# EAGLE design infinity_mirror_rev_g (EAGLE 9.6.2)
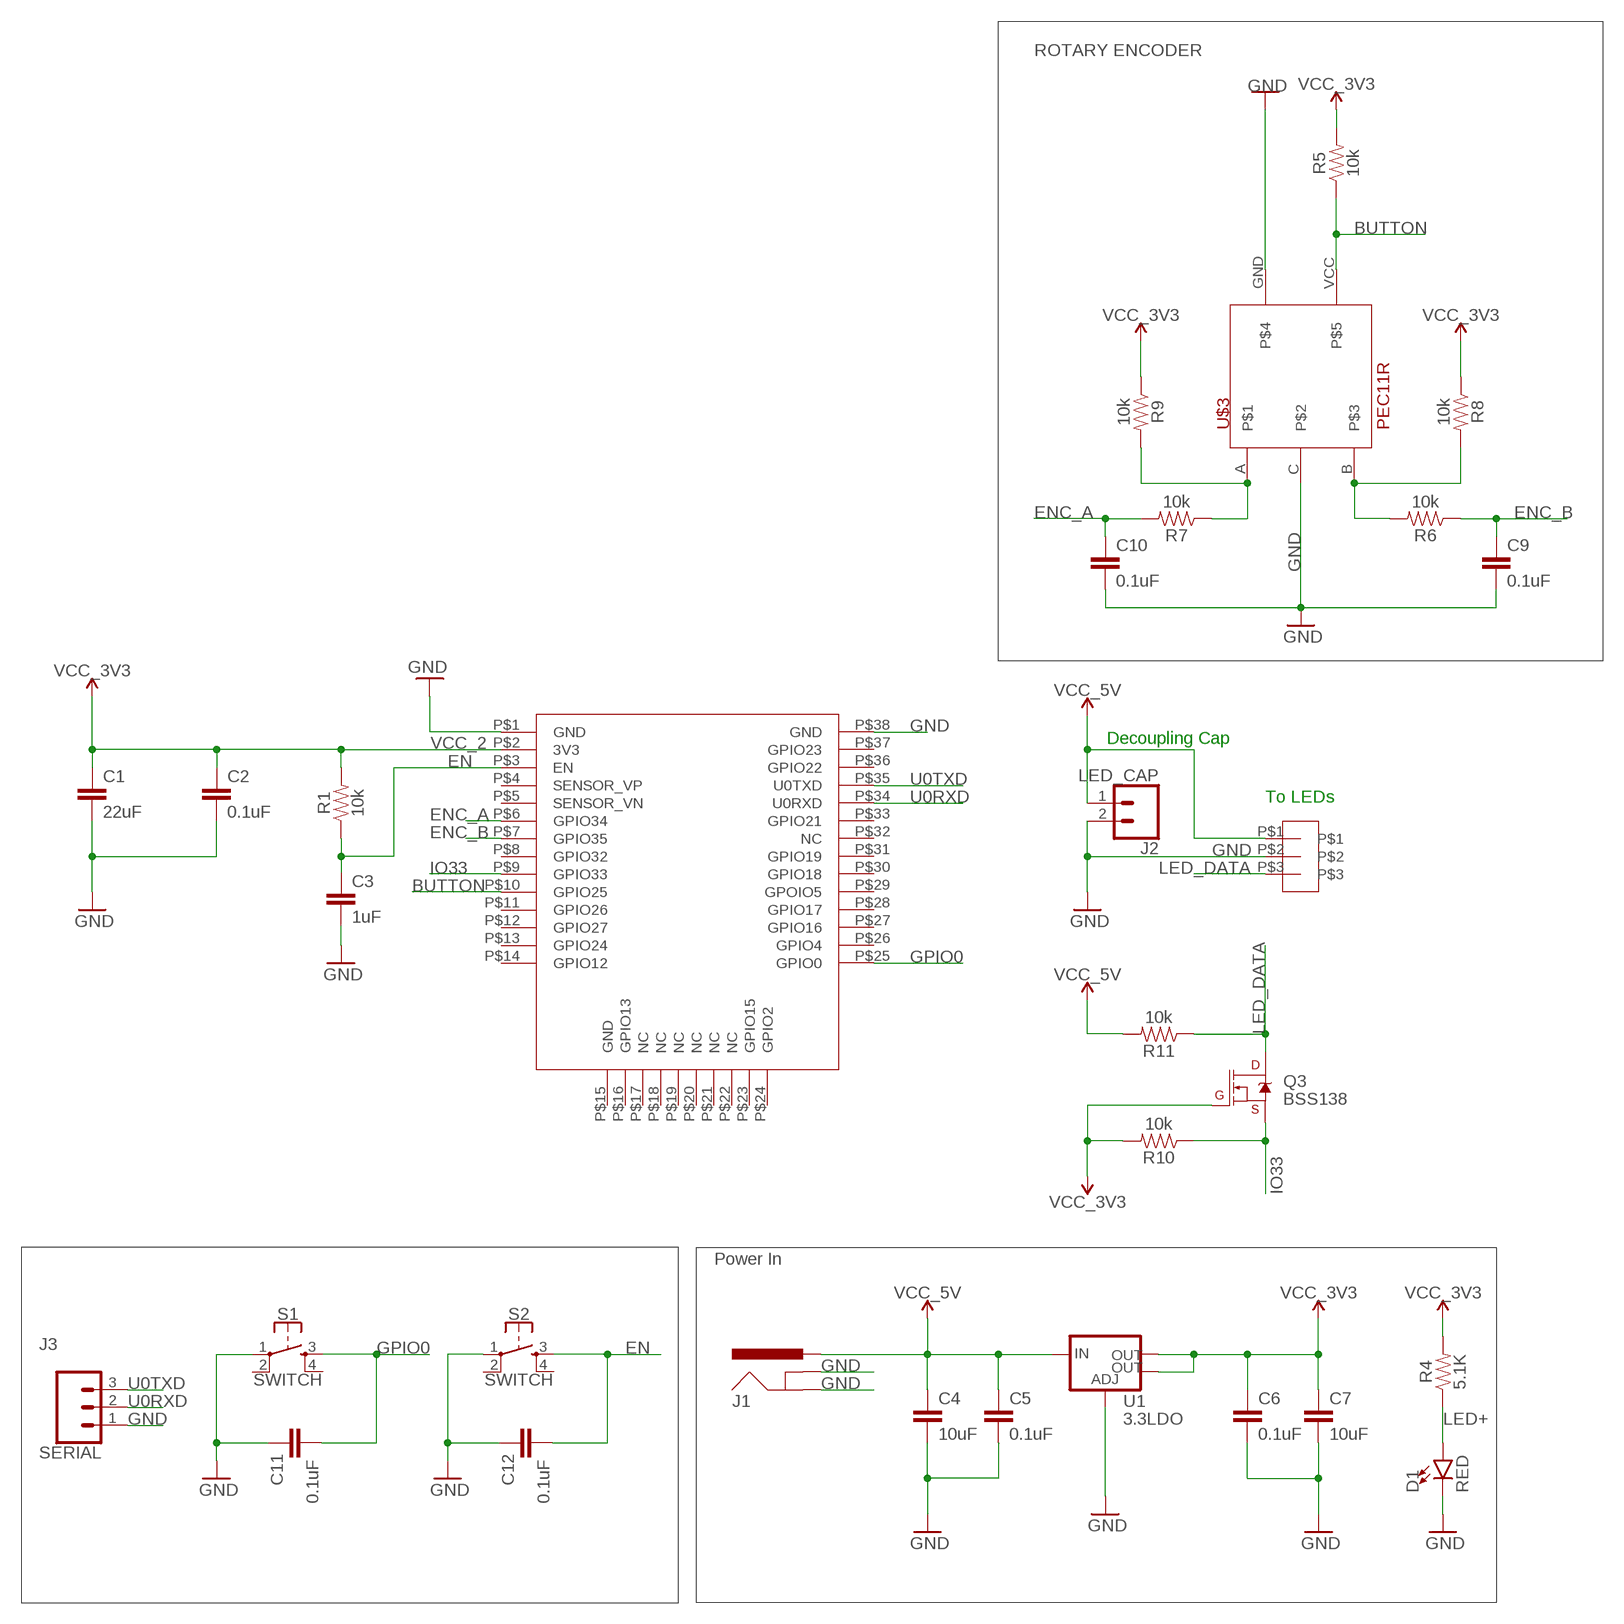
[diagram p0: schematic, sheet 1]

## Parts
C1  22uF  CAPACITOR  [0805]
C2  0.1uF  CAPACITOR  [0805]
C3  1uF  CAPACITOR  [0805]
C4  10uF  CAPACITOR  [0805]
C5  0.1uF  CAPACITOR  [0805]
C6  0.1uF  CAPACITOR  [0805]
C7  10uF  CAPACITOR  [0805]
C9  0.1uF  CAPACITOR  [0805]
C10  0.1uF  CAPACITOR  [0805]
C11  0.1uF  CAPACITOR  [0805]
C12  0.1uF  CAPACITOR  [0805]
D1  RED  LED-RED1206  [LED-1206]
J1  POWER_JACKPTH_BREAD  [POWER_JACK_PTH_BREAD]
J2  LED_CAP  CONN_02  [1X02]
J3  SERIAL  CONN_03  [1X03]
Q3  BSS138  MOSFET-NCH-BSS138  [SOT23-3]
R1  10k  RESISTOR  [0805]
R4  5.1K  RESISTOR  [0805]
R5  10k  RESISTOR  [0805]
R6  10k  RESISTOR  [0805]
R7  10k  RESISTOR  [0805]
R8  10k  RESISTOR  [0805]
R9  10k  RESISTOR  [0805]
R10  10k  RESISTOR  [0805]
R11  10k  RESISTOR  [0805]
S1  SWITCH  MOMENTARY-SWITCH-SPST-2-SMD-5.2MM-TALL  [TACTILE_SWITCH_SMD_5.2MM]
S2  SWITCH  MOMENTARY-SWITCH-SPST-2-SMD-5.2MM-TALL  [TACTILE_SWITCH_SMD_5.2MM]
U1  3.3LDO  V_REG_LM1117SOT223  [SOT223]
U$1  ESP32-WROOM-32E  [ESP32-WROOM-32E]
U$2  3-PIN-JST  [3-PIN-JST]
U$3  PEC11R  PEC11R_ROTARY_ENCODER  [PEC11R-4320F-S0012]

## Nets
BUTTON: R5.1 U$1.P$10(GPIO25) U$3.VCC
EN: C3.1 C12.2 R1.1 S2.3 U$1.P$3(EN)
ENC_A: C10.1 R7.2 U$1.P$6(GPIO34)
ENC_B: C9.1 R6.1 U$1.P$7(GPIO35)
GND: C1.2 C2.2 C3.2 C4.2 C5.2 C6.2 C7.2 C9.2 C10.2 C11.1 C12.1 D1.C J1.GND J1.GNDBREAK J2.2 J3.1 S1.1 S2.1 U1.1(ADJ) U$1.P$1(GND) U$1.P$38(GND) U$2.P$2 U$3.C U$3.GND
GPIO0: C11.2 S1.3 U$1.P$25(GPIO0)
IO33: Q3.2(S) R10.1 U$1.P$9(GPIO33)
LED+: D1.A R4.1
LED_DATA: Q3.3(D) R11.1 U$2.P$3
N$2: R6.2 R8.2 U$3.B
N$3: R7.1 R9.2 U$3.A
U0RXD: J3.2 U$1.P$34(U0RXD)
U0TXD: J3.3 U$1.P$35(U0TXD)
VCC_1: C4.1 C5.1 J1.PWR J2.1 R11.2 U1.3(IN) U$2.P$1 ; supply symbol labelled VCC_5V
VCC_2: C1.1 C2.1 C6.1 C7.1 Q3.1(G) R1.2 R4.2 R5.2 R8.1 R9.1 R10.2 U1.2(OUT) U1.4(OUT) U$1.P$2(3V3) ; supply symbol labelled VCC_3V3
Unconnected: S1.2 S1.4 S2.2 S2.4 U$1.P$4(SENSOR_VP) U$1.P$5(SENSOR_VN) U$1.P$8(GPIO32) U$1.P$11(GPIO26) U$1.P$12(GPIO27) U$1.P$13(GPIO24) U$1.P$14(GPIO12) U$1.P$15(GND) U$1.P$16(GPIO13) U$1.P$17(NC) U$1.P$18(NC) U$1.P$19(NC) U$1.P$20(NC) U$1.P$21(NC) U$1.P$22(NC) U$1.P$23(GPIO15) U$1.P$24(GPIO2) U$1.P$26(GPIO4) U$1.P$27(GPIO16) U$1.P$28(GPIO17) U$1.P$29(GPOIO5) U$1.P$30(GPIO18) U$1.P$31(GPIO19) U$1.P$32(NC) U$1.P$33(GPIO21) U$1.P$36(GPIO22) U$1.P$37(GPIO23)

## Notes on the sheet
- ROTARY ENCODER
- Decoupling Cap
- To LEDs
- Power In

## Library data of the parts
C1-C7 C9-C12 = _111_IH:CAPACITOR
D1 = SparkFun-LED:LED-RED: Red SMD LED Used in manufacturing of most products at SparkFun Packages: 0603 - SMD 0603 package [Product Link] <http://docs.avagotech.com/docs/AV02-0551EN> 0603 SMART - SMD 0603 SMART package ( more efficient and expensive)[Product Link] <http://www.osram-os.com/Graphics/XPic2/00077099_0.pdf> 1206 - SMD1206 package [Product Link] <https://www.sparkfun.com/datasheets/DevTools/LilyPad/Q150OVS4.pdff> SparkFun Products: Pro Mini 328 -5V <https://www.sparkfun.com/products/821> RedBoard <https://www.sparkfun.com/products/12757> IOIO-OTG <https://www.sparkfun.com/products/13613>; PROD_ID: DIO-09912
J1 = SparkFun-Connectors:POWER_JACK: Power Jack Connector This is the standard 5.5mm barrel jack for power. The PTH is the most common, proven, reliable, footprint. The Slot footprint only works if the mill layer is transmitted to the PCB fab house so be warned. Here are the connectors we sell at SparkFun: DC Barrel Power Jack/Connector <https://www.sparkfun.com/products/119> (PRT-00119) DC Barrel Power Jack/Connector (SMD) <https://www.sparkfun.com/products/12748> (PRT-12748) DC Barrel Jack Adapter - Breadboard Compatible <https://www.sparkfun.com/products/10811> (PRT-10811) It is used on this SparkFun product (and many, many others): SparkFun RedBoard - Programmed with Arduino <https://www.sparkfun.com/products/12757> (DEV-12757) Also, if you need a mating power supply or connector, please check these out: Wall Adapter Power Supply - 9VDC 650mA <https://www.sparkfun.com/products/298> (TOL-00298) DC Barrel Jack Adapter - Male <https://www.sparkfun.com/products/10287> (PRT-10287); PROD_ID: PRT-10811
J2 = SparkFun-Connectors:CONN_02: Multi connection point. Often used as Generic Header-pin footprint for 0.1 inch spaced/style header connections On any of the 0.1 inch spaced packages, you can populate with these: Break Away Headers - Straight <https://www.sparkfun.com/products/116> (PRT-00116) Break Away Male Headers - Right Angle <https://www.sparkfun.com/products/553> (PRT-00553) Female Headers <https://www.sparkfun.com/products/115> (PRT-00115) Break Away Headers - Machine Pin <https://www.sparkfun.com/products/117> (PRT-00117) Break Away Female Headers - Swiss Machine Pin <https://www.sparkfun.com/products/743> (PRT-00743) For SCREWTERMINALS and SPRING TERMINALS visit here: Screw Terimnals on SparkFun.com <https://www.sparkfun.com/search/results?term=Screw+Terminals> (5mm/3.5mm/2.54mm spacing) This device is also useful as a general connection point to wire up your design to another part of your project. Our various solder wires solder well into these plated through hole pads. Hook-Up Wire - Assortment (Stranded, 22 AWG) <https://www.sparkfun.com/products/11375> (PRT-11375) Hook-Up Wire - Assortment (Solid Core, 22 AWG) <https://www.sparkfun.com/products/11367> (PRT-11367) View the entire wire category on our website here <https://www.sparkfun.com/categories/141> Special notes: Molex polarized connector foot print use with: PRT-08233 with associated crimp pins and housings. 2.54_SCREWTERM for use with PRT-10571. 3.5mm Screw Terminal footprints for PRT-08084 5mm Screw Terminal footprints for use with PRT-08432
J3 = SparkFun-Connectors:CONN_03: Multi connection point. Often used as Generic Header-pin footprint for 0.1 inch spaced/style header connections On any of the 0.1 inch spaced packages, you can populate with these: Break Away Headers - Straight <https://www.sparkfun.com/products/116> (PRT-00116) Break Away Male Headers - Right Angle <https://www.sparkfun.com/products/553> (PRT-00553) Female Headers <https://www.sparkfun.com/products/115> (PRT-00115) Break Away Headers - Machine Pin <https://www.sparkfun.com/products/117> (PRT-00117) Break Away Female Headers - Swiss Machine Pin <https://www.sparkfun.com/products/743> (PRT-00743) Stackable Header - 3 Pin (Female, 0.1") <https://www.sparkfun.com/products/13875> (PRT-13875) For SCREWTERMINALS and SPRING TERMINALS visit here: Screw Terimnals on SparkFun.com <https://www.sparkfun.com/search/results?term=Screw+Terminals> (5mm/3.5mm/2.54mm spacing) This device is also useful as a general connection point to wire up your design to another part of your project. Our various solder wires solder well into these plated through hole pads. Hook-Up Wire - Assortment (Stranded, 22 AWG) <https://www.sparkfun.com/products/11375> (PRT-11375) Hook-Up Wire - Assortment (Solid Core, 22 AWG) <https://www.sparkfun.com/products/11367> (PRT-11367) View the entire wire category on our website here <https://www.sparkfun.com/categories/141> Special notes: Molex polarized connector foot print use with SKU : PRT-08232 with associated crimp pins and housings.
Q3 = SparkFun-DiscreteSemi:MOSFET-NCH: N-channel MOSFETs Voltage controlled devices that allow control of high current outputs. SparkFun Products: SparkFun OpenScale <https://www.sparkfun.com/products/13261> SparkFun Digital Sandbox <https://www.sparkfun.com/products/12651> SparkFun Monster Moto Shield <https://www.sparkfun.com/products/10182> SparkFun MOSFET Power Controller <https://www.sparkfun.com/products/11214>; PROD_ID: TRANS-00830; VALUE: 220mA/50V/3.5Ω
R1 R4-R11 = _111_IH:RESISTOR
S1 S2 = SparkFun-Switches:MOMENTARY-SWITCH-SPST-2: Momentary Switch (Pushbutton) - SPST - Two Circuits Normally-open (NO) SPST momentary switches (buttons, pushbuttons). Schematic symbol includes two switch circuits. Variants SMD-4.6MMX2.8MM - 4.60mm x 2.80mm Tactile Momentary Button Switch - Used on SparkFun Pro Micro - RP2040 <https://www.sparkfun.com/products/17717> SMD-5.2MM - Mini Pushbutton Switch - SMD <https://www.sparkfun.com/products/8720> - Used on Arduino Pro Mini <https://www.sparkfun.com/products/11114>; PROD_ID: SWCH-14139
U1 = SparkFun-IC-Power:V_REG_LM1117: Voltage Regulator LM1117 Standard adjustable voltage regulator but in SMD form. Spark Fun Electronics SKU : COM-00595; PROD_ID: VREG-08170
U$1 = infinity_mirror_revd:ESP32-WROOM-32E
U$2 = infinity_mirror_revd:3-PIN-JST
U$3 = infinity_mirror_revd:PEC11R_ROTARY_ENCODER: 4 = PC Pin Horizontal / Rear Facing 3 = 12 Detents 20 = 20.0mm long shaft F = Metal Flatted Shaft S = Push Momentary Switch 001 = 12 pulses per 360

## Board
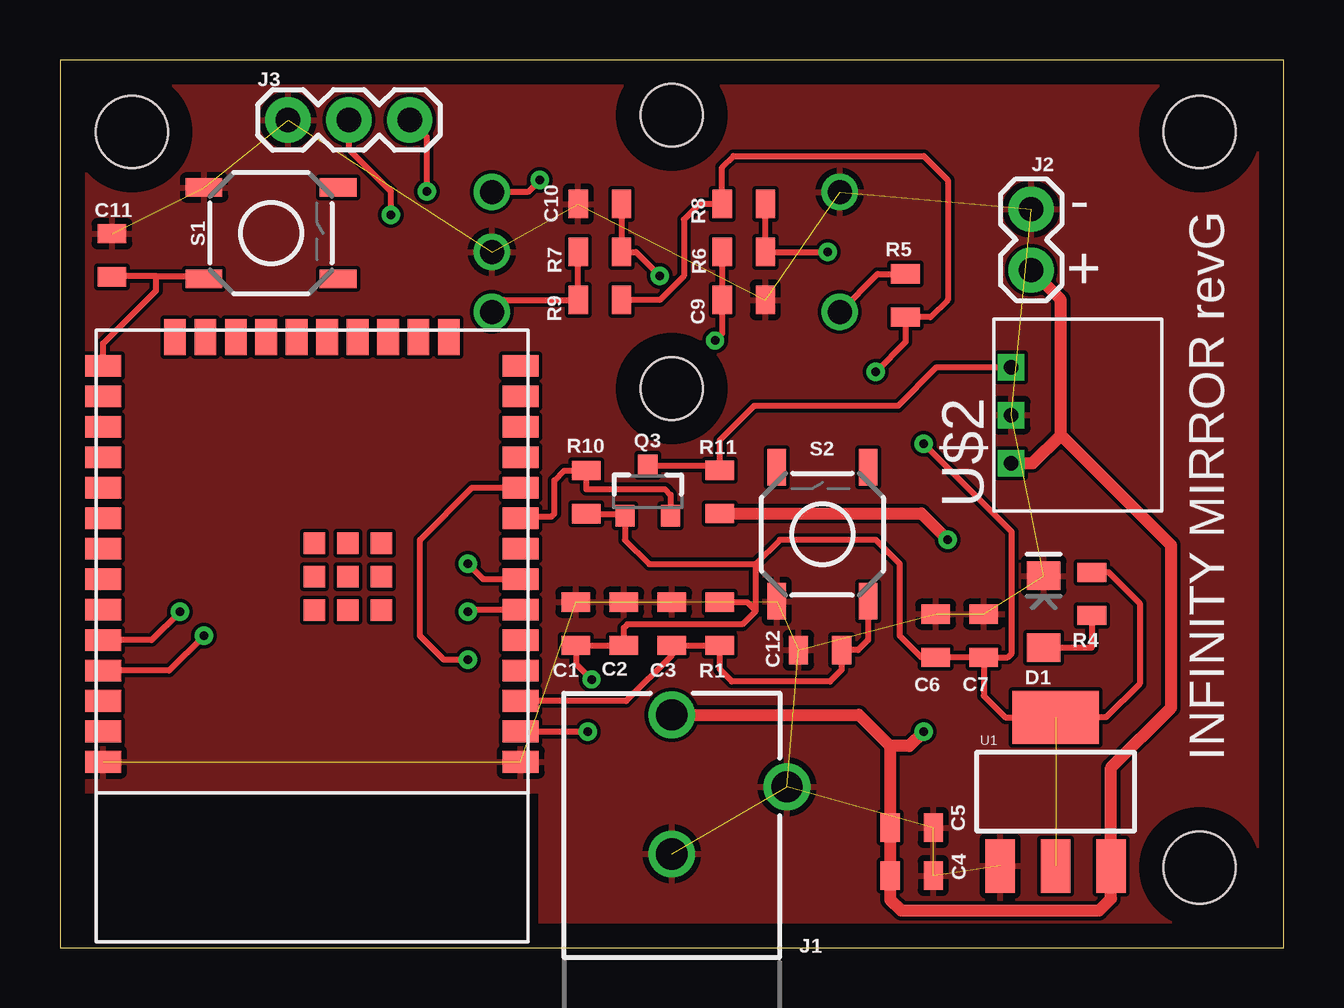
[diagram p1: board, top side]
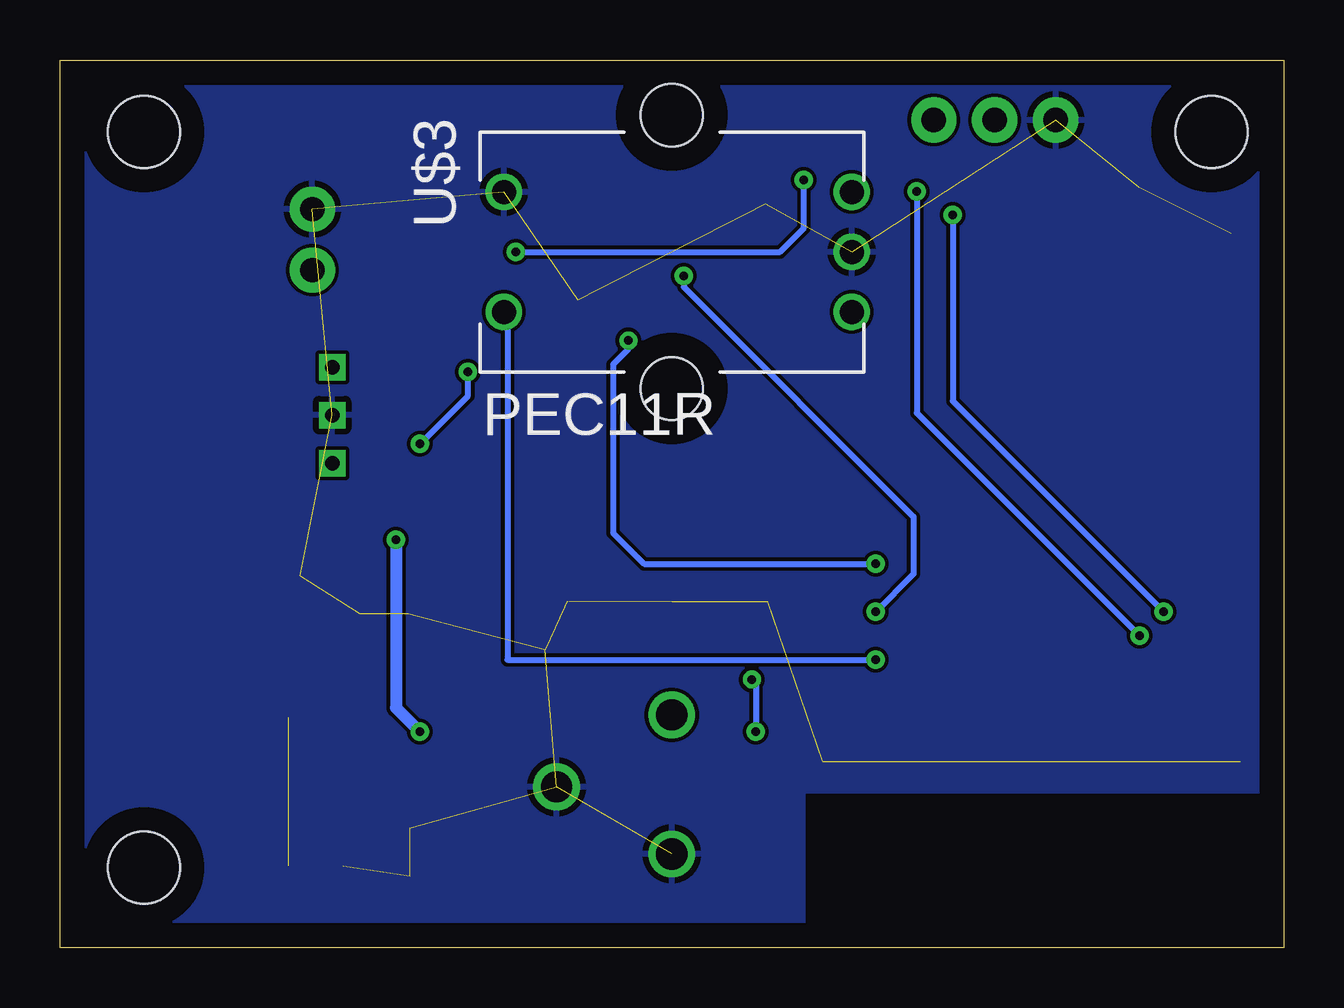
[diagram p2: board, bottom side, seen from below]

Size 51 x 37 mm. Coordinates in mm from the lower left corner, seen from the top.
Outline: 0,0 51,0 51,37 0,37 0,0
Copper layers (1*16): Top 0.035mm / dielectric 1.5mm / Bottom 0.035mm
Design rules "default": minimum track width 6mil, minimum drill 0.35mm, track to track 6mil, track to pad 6mil, pad to pad 6mil, via to via 6mil, smd to smd 6mil, copper to edge 40mil, drill to drill 6mil, minimum pad ring 10mil, minimum via ring 8mil, stop-mask expansion 4mil, vias tented up to drill 0mil, thermal gap 10mil
Holes 3 mm at 3,34 47.5,34 47.5,3.33
tKeepout: area 0.5,31.5 to 5.5,36.5; area 45,0.8 to 50,5.8; area 45,31.5 to 50,36.5

### Footprints (pad centres in the part's own frame; a part is rotated, then mirrored left to right if it is on the bottom)
0805 = smd 0.8 x 1.2: 1 -0.9,0; 2 0.9,0
LED-1206 = smd 1.2 x 1.4: A -1.5,0; C 1.5,0
POWER_JACK_PTH_BREAD = drill 1.3: GND 0,7.9; GNDBREAK 4.8,10.7; PWR 0,13.7
1X02 = drill 1.016 pad 1.88: 1 0,0; 2 2.54,0
1X03 = drill 1.016 pad 1.88: 1 0,0; 2 2.54,0; 3 5.08,0
SOT23-3 = smd 0.8 x 0.9: 1 -0.95,-1; 2 0.95,-1; 3 0,1.1
TACTILE_SWITCH_SMD_5.2MM = smd 1.524 x 0.762: 1 -2.794,1.905; 2 2.794,1.905; 3 -2.794,-1.905; 4 2.794,-1.905
SOT223 = smd 1.219 x 2.235: 1 -2.311,-3.099; 2 0,-3.099; 3 2.311,-3.099 | smd 3.6 x 2.2: 4 0,3.099
ESP32-WROOM-32E = smd 1.5 x 0.9: P$1 0.3,18.01; P$2 0.3,16.74; P$3 0.3,15.47; P$4 0.3,14.2; P$5 0.3,12.93; P$6 0.3,11.66; P$7 0.3,10.39; P$8 0.3,9.12; P$9 0.3,7.85; P$10 0.3,6.58; P$11 0.3,5.31; P$12 0.3,4.04; P$13 0.3,2.77; P$14 0.3,1.5; P$25 17.7,1.5; P$26 17.7,2.77; P$27 17.7,4.04; P$28 17.7,5.31; P$29 17.7,6.58; P$30 17.7,7.85; P$31 17.7,9.12; P$32 17.7,10.39; P$33 17.7,11.66; P$34 17.7,12.93; P$35 17.7,14.2; P$36 17.7,15.47; P$37 17.7,16.74; P$38 17.7,18.01 | smd 0.9 x 1.5: P$15 3.285,0.3; P$16 4.555,0.3; P$17 5.825,0.3; P$18 7.095,0.3; P$19 8.365,0.3; P$20 9.635,0.3; P$21 10.905,0.3; P$22 12.175,0.3; P$23 13.445,0.3; P$24 14.715,0.3 | smd 0.9 x 0.9: P$39 7.5,10.29; P$40 6.1,11.69; P$41 7.5,11.69; P$42 8.9,11.69; P$43 8.9,10.29; P$44 8.9,8.89; P$45 7.5,8.89; P$46 6.1,8.89; P$47 6.1,10.29
3-PIN-JST = drill 0.6 square: P$1 -2,0; P$2 0,0; P$3 2,0
PEC11R-4320F-S0012 = drill 1: A -2.5,-7.5; B 2.5,-7.5; C 0,-7.5; GND 2.5,7; VCC -2.5,7 | hole 2.6: -5.7,0; 5.7,0

### Placement (x,y rotation side)
C1  21.5,13.5 90 top
C2  23.5,13.5 90 top
C3  25.5,13.5 90 top
C4  35.5,3 0 top
C5  35.5,5 0 top
C6  36.5,13 90 top
C7  38.5,13 90 top
C9  28.5,27 0 top
C10  22.5,31 180 top
C11  2.17,28.86 270 top
C12  31.68,12.4 0 top
D1  41,14 90 top
J1  25.5,-4 0 top
J2  40.48,28.24 90 top
J3  9.5,34.5 0 top
Q3  24.5,19 0 top
R1  27.5,13.5 90 top
R4  43.01,14.74 90 top
R5  35.24,27.18 270 top
R6  28.5,29 0 top
R7  22.5,29 0 top
R8  28.5,31 0 top
R9  22.5,27 180 top
R10  21.94,18.98 270 top
R11  27.5,19 270 top
S1  8.8,29.78 0 top
S2  31.78,17.23 90 top
U1  41.5,6.5 0 top
U$1  19.5,25.75 180 top
U$2  39.65,22.19 90 top
U$3  25.5,29 90 bottom

### Tracks (layer width: path | path; a pad name or v marks a point on that pad's centre or on a via)
BUTTON  (via drill 0.35)
  Top 0.254: U$3.VCC 34.08,28.08 R5.1 | v17,12 16,12 15,13 15,17 17.17,19.17 U$1.P$10
  Bottom 0.254: U$3.VCC 32.35,26.35 32.35,12 v17,12
EN
  Top 0.254: S2.3 33.69,12.81 33.27,12.4 C12.2 32.58,11.58 32.09,11.09 28.01,11.09 27.5,11.6 R1.1 C3.1 25.5,12.18 23.6,10.28 U$1.P$3
ENC_A  (via drill 0.35)
  Top 0.254: C10.1 R7.2 24,29 v25,28 | v17,14 17.09,14.09 U$1.P$6
  Bottom 0.254: v25,28 25,27.54 15.42,17.95 15.42,15.58 v17,14
ENC_B  (via drill 0.35)
  Top 0.254: R6.1 C9.1 27.6,25.6 v27.3,25.3 | v17,16 17.64,15.36 U$1.P$7
  Bottom 0.254: v27.3,25.3 27.3,24.95 27.94,24.31 27.94,17.29 26.66,16 v17,16
GND  (23 unrouted)
  pour Top: 0,37 51,37 51,0 20,0 20,6.5 0,6.5
  pour Bottom: 0,37 0,6.5 20,6.5 20,0 51,0 51,37
GPIO0
  Top 0.152: 5.88,28 S1.3 | 2.21,28 C11.2
  Top 0.254: U$1.P$25 1.8,25.18 4,27.38 4,28 | 4,28 5.88,28 | 4,28 2.21,28
IO33
  Top 0.254: Q3.2 25.45,18.87 25.21,19.11 21.94,19.11 R10.1 | 21.94,19.98 R10.1 | U$1.P$9 19.26,17.96 20.48,17.96 20.61,18.09 20.61,19.47 21.02,19.88 R10.1
LED+
  Top 0.254: R4.1 43.01,12.5 D1.A
LED_DATA
  Top 0.152: 27.3,20.1 R11.1
  Top 0.254: Q3.3 27.3,20.1 | R11.1 27.5,21.15 28.93,22.58 34.93,22.58 36.54,24.19 U$2.P$3
N$2  (via drill 0.35)
  Top 0.254: R8.2 R6.2 v32,29 | v20,32 19.5,31.5 U$3.B
  Bottom 0.254: v20,32 20,30 21,29 v32,29
N$3
  Top 0.254: R7.1 R9.2 18.5,27 U$3.A
U0RXD  (via drill 0.35)
  Top 0.254: v13.79,30.54 13.79,31.54 12.04,33.29 J3.2 | v5,14 3.82,12.82 U$1.P$34
  Bottom 0.254: v13.79,30.54 13.79,22.79 v5,14
U0TXD  (via drill 0.35)
  Top 0.254: J3.3 15.29,33.79 v15.29,31.52 | v6,13 4.55,11.55 U$1.P$35
  Bottom 0.254: v15.29,31.52 15.29,22.29 v6,13
VCC_1  (via drill 0.35)
  Top 0.508: J1.PWR 33.3,9.7 34.6,8.4 | 34.6,8.4 C5.1 C4.1 34.6,2 35.06,1.53 43.3,1.53 43.81,2.04 U1.3 43.81,7.51 46.3,10 46.3,16.78 41.72,21.37 | R11.2 35.9,18.1 v37,17 | v36,9 35.4,8.4 34.6,8.4 | 41.72,21.37 41.72,27 J2.1 | U$2.P$1 40.54,20.19 41.72,21.37
  Bottom 0.508: v37,17 37,10 v36,9
VCC_2  (via drill 0.35)  (1 unrouted)
  Top 0.152: 29,14.04 28.98,14.02 | U$1.P$2 | 23.47,18.08 Q3.1
  Top 0.254: C7.1 38.5,10.5 39.4,9.6 U1.4 43.6,9.6 45,11 45,14.35 43.71,15.64 R4.2 | C7.1 C6.1 35.9,12.1 35,13 35,16 34,17 30,17 28.98,15.98 | R1.2 28.64,14.4 29,14.04 | v22.16,11.17 21.5,11.83 C1.1 C2.1 23.5,13.32 23.66,13.48 28.44,13.48 28.98,14.02 28.98,15.98 | v22,9 U$1.P$2 | 28.98,15.98 24.57,15.98 23.55,17 Q3.1 | R10.2 23.47,18.08 | C7.1 39.5,12.1 39.67,12.27 39.67,17.33 v36,21 | v34,24 35.24,25.24 R5.2 36.28,26.28 37,27 37,32 36,33 28.07,33 27.6,32.53 R8.1 26.65,31 26,30.35 26,28 25,27 R9.1
  Bottom 0.152: v22.16,11.17 22,11.01
  Bottom 0.254: 22,11.01 v22,9 | v36,21 34,23 v34,24

### Text on the board
tPlace: - | +
tSilk: INFINITY MIRROR revG